# Altium schematic sheet LM2678.SchDoc
size A4; SheetNumber: 1; SheetTotal: 2
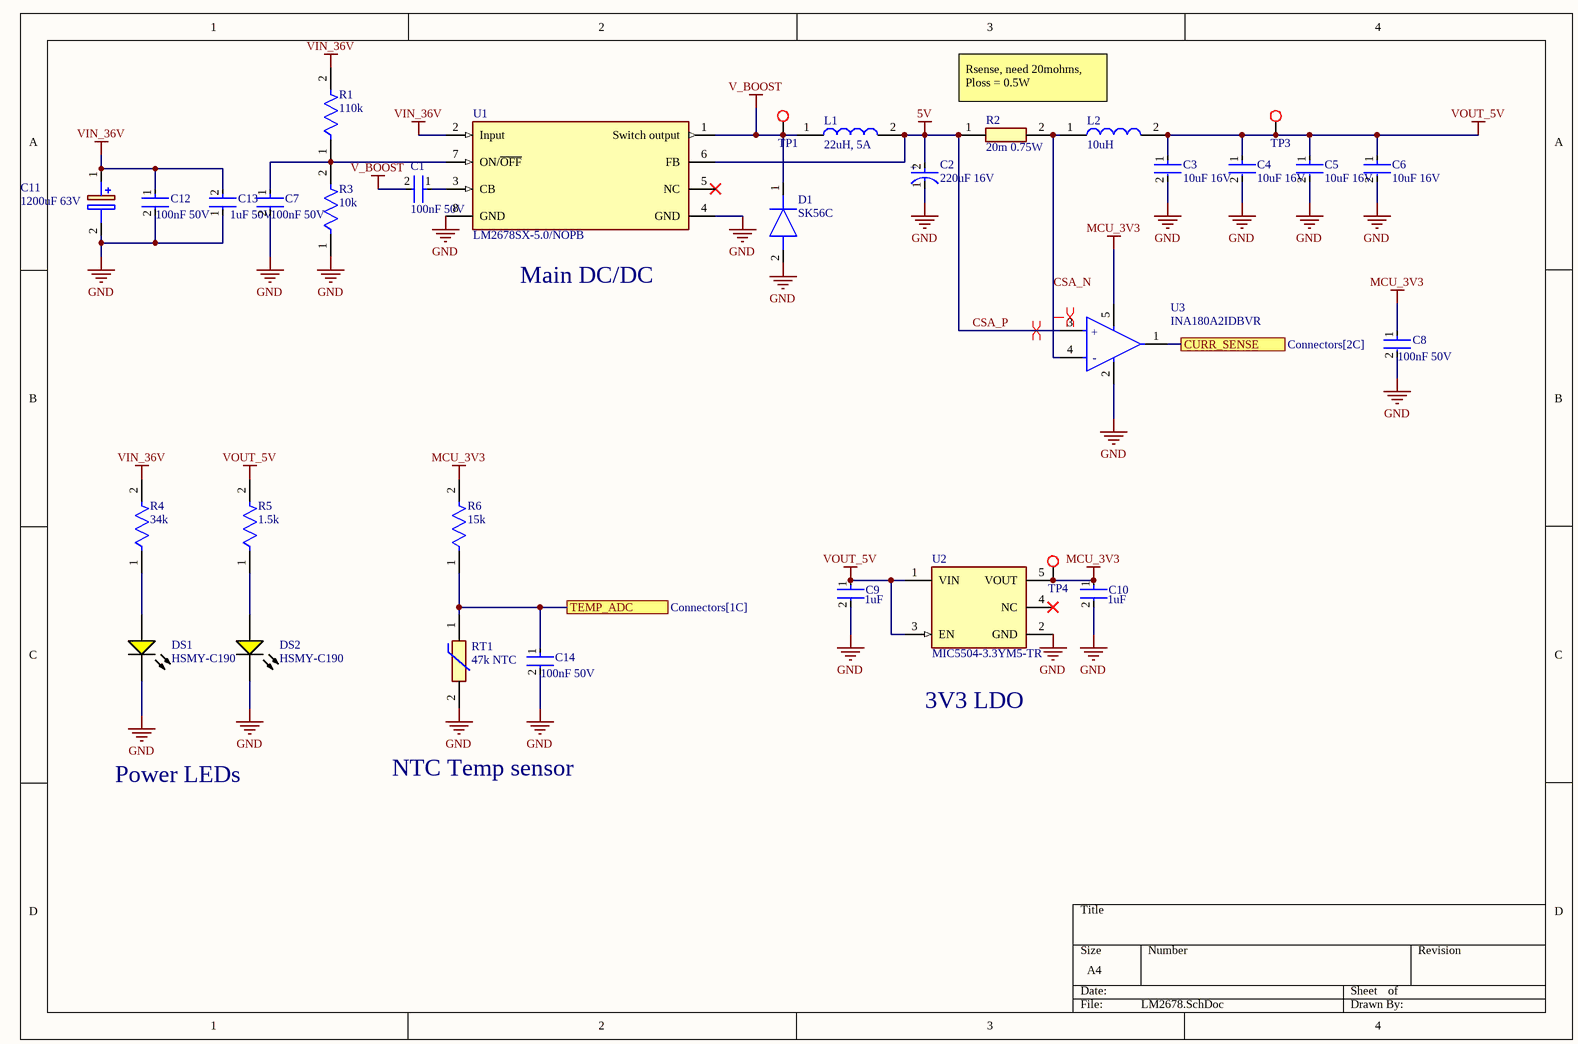
[diagram p0: LM2678.SchDoc]

## Parts
C1  100nF 50V  [FP-CL31-IPC_C]
C2  220uF 16V  [FP-OS-CON-TH-E7-d_0_6-MFG]
C3  10uF 16V  [FP-CL21-IPC_B]
C4  10uF 16V  [FP-CL21-IPC_B]
C5  10uF 16V  [FP-CL21-IPC_B]
C6  10uF 16V  [FP-CL21-IPC_B]
C7  100nF 50V  [FP-CL31-IPC_C]
C8  100nF 50V  [FP-CL31-IPC_C]
C9  1uF  [FP-CL10-IPC_C]
C10  1uF  [FP-CL10-IPC_C]
C11  1200uF 63V  [CAPPRD750W80D1825H3750]
C12  100nF 50V  [FP-CL31-IPC_C]
C13  1uF 50V  [FP-C1608-080-0_1-IPC_B]
C14  100nF 50V  [FP-CL31-IPC_C]
D1  SK56C  [DIOM7959X262N]
DS1  HSMY-C190  [AVAG-HSMX-C190_V]
DS2  HSMY-C190  [AVAG-HSMX-C190_V]
L1  22uH, 5A  [AMRM00101040220MA1]
L2  10uH  [HPC8040NC4R7M]
R1  110k  [FP-RC2012-MFG]
R2  20m 0.75W  [RESC2114X85N]
R3  10k  [FP-MC01W0805-IPC_C]
R4  34k  [FP-CRCW0805-e3-IPC_B]
R5  1.5k  [FP-RC1608-IPC_B]
R6  15k  [FP-CRCW1206-e3-IPC_B]
RT1  47k NTC  [NTCLE100E3473GB0]
TP1  TP  [Testpoint]  (value not drawn)  (no BOM)
TP3  TP  [Testpoint]  (value not drawn)  (no BOM)
TP4  TP  [Testpoint]  (value not drawn)  (no BOM)
U1  LM2678SX-5.0/NOPB  [LM2678SX-5.0/NOPB]
U2  MIC5504-3.3YM5-TR  [FP-SOT23-5LD-PL-1-MFG]
U3  INA180A2IDBVR  [FP-DBV0005A-MFG]

## Ports
CURR_SENSE (see Connectors[2C]), TEMP_ADC (see Connectors[1C])

## Nets
CSA_P: C2.2(A) L1.2 R2.1 U1.6(FB) U3.3(IN+)  [also labelled 5V]
GND: C2.1(C) C3.2 C4.2 C5.2 C6.2 C7.2 C8.2 C9.2 C10.2 C11.2(-) C12.2 C13.1 C14.2 D1.2(A) DS1.2(K) DS2.2(K) R3.1 RT1.2 U1.4(GND) U1.8(GND) U2.2(GND) U3.2(GND)
MCU_3V3: C8.1 C10.1 R6.2 TP4.0 U2.5(VOUT) U3.5(VS)
V_BOOST: C1.2 D1.1(K) L1.1 TP1.0 U1.1(Switch_output)
VIN_36V: C11.1(+) C12.1 C13.2 R1.2 R4.2 U1.2(Input)
VOUT_5V: C3.1 C4.1 C5.1 C6.1 C9.1 L2.2 R5.2 TP3.0 U2.1(VIN) U2.3(EN)
CSA_N: L2.1 R2.2 U3.4(IN-)
CURR_SENSE: U3.1(OUT) ; port CURR_SENSE
TEMP_ADC: C14.1 R6.1 RT1.1 ; port TEMP_ADC
NetC1_1: C1.1 U1.3(CB)
NetC7_1: C7.1 R1.1 R3.2 U1.7(ON/~{OFF})
NetDS1_1: DS1.1(A) R4.1
NetDS2_1: DS2.1(A) R5.1

Not connected (* = marked no-connect by the designer): U1 5(NC)*; U2 4(NC)*

## Layout directives
differential pair: CSA_N, CSA_P

## Notes on the sheet
- Rsense, need 20mohms, Ploss = 0.5W
- (near U1) Main DC/DC
- 3V3 LDO
- Power LEDs
- NTC Temp sensor
- (in symbol CMP-04895-000287-1) +; -
- (in symbol CMP-05428-000165-2) +

## Library data of the parts
C1 C7 C8 C12 C14 = CMP-13271-001276-1: Cap Ceramic 100nF 50V X7R ±10% SMD 1206 +125°C Embossed T/R; Dielectric: X7R; Case Code (Metric): 3216; Package Quantity: 1; Thickness: 0.037inch; Depth: 1.6mm; Packaging: Tape and Reel; Capacitance: 100nF; Length: 0.126inch; Tolerance: 10%; Voltage Rating: 50V; Case Code (Imperial): 1206; Radiation Hardening: No; Width: 0.063inch; Case/Package: 1206; Max Operating Temperature: 125°C; Min Operating Temperature: -55°C; Height: 0.85mm; Mount: Surface Mount
C2 = CMP-05428-000165-2: CAP ALUM POLY 220UF 20% 16V T/H; Life (Hours): 5000Hour; Dissipation Factor: 10%; Leakage Current: 500uA; Lead Diameter: 0.6mm; Ripple Current: 4.15A; ESR (Equivalent Series Resistance): 13mR; Polarity: Polar; Reach SVHC Compliant: Yes; Voltage Rating (DC): 16V; Number of Pins: 7; Length: 7mm; Voltage: 16V; Diameter: 8mm; RoHS Compliant: Yes; Max Operating Temperature: 105°C; Height: 7mm; Capacitance: 220uF; Tolerance: 20%; Voltage Rating: 16V; Mount: Through Hole; Series: OS-CON™, SEPC; Packaging: Bulk; Package Quantity: 200; Termination: Radial; Min Operating Temperature: -55°C; Case/Package: Radial; Lead Pitch: 3.5mm; Height - Seated (Max): 0.276inch; Lead Free: Lead Free
C3-C6 = CMP-2000-06102-2: CL21 Series 0805 10uF 16V ±10% Tolerance X5R Multilayer Ceramic Chip Capacitor; Dielectric: X7R; Length: 2mm; Depth: 1.25mm; Voltage: 16V; Width: 0.049inch; Capacitance: 10uF; Lead Free: Lead Free; Max Operating Temperature: 85°C; Mount: Surface Mount; Voltage Rating: 16V; Height: 1.25mm; Radiation Hardening: No; Packaging: Tape and Reel; Voltage Rating (DC): 16V; Thickness: 0.055inch; Case/Package: 0805; Case Code (Imperial): 0805; Min Operating Temperature: -55°C; Case Code (Metric): 2012; Package Quantity: 1; Tolerance: 10%
C9 C10 = CMP-13271-003399-1: Cap Ceramic 1uF 10V X5R ±10% Pad SMD 0603 +85°C T/R; Min Operating Temperature: -55°C; Max Operating Temperature: 85°C; Dielectric: X5R; Contact Plating: Tin; Height: 0.8mm; Voltage: 10V; Packaging: Tape and Reel; Voltage Rating: 10V; Capacitance: 1uF; Package Quantity: 1; Width: 0.031inch; Length: 1.6mm; Depth: 0.8mm; Case/Package: 0603; Case Code (Imperial): 0603; Thickness: 0.035inch; Radiation Hardening: No; Tolerance: 10%; Case Code (Metric): 1608; Mount: Surface Mount
C11 = UHE1J122MHD6: Capacitor Polarised; Manufacturer_Name: Nichicon; Datasheet Link: https://products.nichicon.co.jp/en/pdf/XJA043/e-uhe.pdf; Height: 37.5mm; Manufacturer_Part_Number: UHE1J122MHD6; Mouser Part Number: 647-UHE1J122MHD6; Mouser Price/Stock: https://www.mouser.co.uk/ProductDetail/Nichicon/UHE1J122MHD6?qs=3w7tHOhcdefSsEo8Zd8Pmw%3D%3D; Arrow Part Number: UHE1J122MHD6; Arrow Price/Stock: https://www.arrow.com/en/products/uhe1j122mhd6/nichicon; Supplier 1: Digikey; Supplier Part Number 1: 493-1656-ND
C13 = CMP-2000-06025-2: Multilayer Ceramic Capacitors 1μF ±10% 50V X5R SMD 0603; Lead Free: Lead Free; Height: 0.8mm; Mount: Surface Mount; Radiation Hardening: No; Thickness: 0.035inch; Length: 1.6mm; Max Operating Temperature: 85°C; REACH SVHC: No SVHC; Min Operating Temperature: -55°C; Construction: Flat; RoHS Compliant: Yes; Voltage Rating: 50V; Dielectric: X5R; Packaging: Tape and Reel; Termination: SMD/SMT; Voltage Rating (DC): 50V; Case Code (Imperial): 0603; Voltage: 50V; Width: 0.031inch; Weight: 7.1E-05oz; Capacitance: 1uF; Depth: 0.8mm; Case Code (Metric): 1608; Series: C; Case/Package: 0603; Tolerance: 10%; Resistor Type: Ceramic; Number of Pins: 2; Dielectric Material: Ceramic; Package Quantity: 1
D1 = SK56C: Diode; Manufacturer_Name: Taiwan Semiconductor; Datasheet Link: https://mouser.componentsearchengine.com/Datasheets/2/SK56C.pdf; Height: 2.62mm; Manufacturer_Part_Number: SK56C; Mouser Part Number: 821-SK56C; Mouser Price/Stock: https://www.mouser.co.uk/ProductDetail/Taiwan-Semiconductor/SK56C?qs=tHU%2FlV7kTyQlv9uyXcuY8g%3D%3D
DS1 DS2 = CMP-1744-00003-1: LED Uni-Color Yellow, 65 mW, 20 mA, -40 to 85 degC, 2-Pin SMD, RoHS, Tape and Reel; Tolerance: 1%; Voltage Rating: 50 V; Power Rating: 100 mW; Case\Package: 0603; Resistance: 390 Ohm; Min Operating Temperature: -55 degC; Length: 1.6 mm; ComponentLink3Description: Package Specification; Mount: Surface Mount; PackageReference: HSMX-C190; ComponentLink2Description: Datasheet; DatasheetVersion: Mar-12; Case Code (Metric): 1608; Pins: 2; Package Quantity: 5000; ComponentLink2URL: http://docs.avagotech.com/docs/AV02-0551EN; ComponentLink1Description: Manufacturer URL; RoHSCompliant: true; Packaging: Tape and Reel; PackageDescription: 2-Pin Surface Mount Device, Body 1.6 x 0.8 mm, Height 0.9 mm; REACH SVHC: No SVHC; ComponentLink3URL: http://www.fairchildsemi.com/dwg/MA/MA03D.pdf; Voltage Rating (DC): 50 V; Width: 0.8 mm; ComponentLink1URL: http://www.avagotech.com/; Max Operating Temperature: 155 degC; Case Code (Imperial): 0603; Height: 0.45 mm
L1 = AMRM00101040220MA1: Inductor; Manufacturer_Name: Pulse Electronics; Datasheet Link: https://productfinder.pulseelectronics.com/api/open/part-attachments/datasheet/amrm00101040220ma1; Height: 4mm; Manufacturer_Part_Number: AMRM00101040220MA1; Mouser Part Number: 673-AMRM101040220MA1; Mouser Price/Stock: https://www.mouser.co.uk/ProductDetail/Pulse-Electronics/AMRM00101040220MA1?qs=HoCaDK9Nz5furma8MQ%2FytQ%3D%3D
L2 = HPC8040NC-4R7M: Inductor; Manufacturer_Name: TAI-TECH; Datasheet Link: https://media.digikey.com/pdf/Data%20Sheets/Tai%20Tech%20PDFs/HPC-BM_NF_NCv.pdf; Height: 4.2mm; Manufacturer_Part_Number: HPC8040NC-4R7M; Supplier 1: Digikey; Supplier Part Number 1: 4816-HPC8040NC-100MCT-ND
R1 = CMP-13261-001773-1: Res Thick Film 0805 110kΩ 1% 0.125W ±100ppm/°C Molded SMD T/R; Resistance: 110kR; Max Power Dissipation: 125mW; Voltage Rating (DC): 150V; Packaging: Tape and Reel; Height: 0.024inch; Case/Package: 0805; Composition: Thick Film; Features: Moisture Resistant; Contact Plating: Tin; Military Standard: Not; Case Code (Imperial): 0805; Tolerance: 1%; Width: 0.049inch; Number of Terminations: 2; Lead Free: Lead Free; Min Operating Temperature: -55°C; Radiation Hardening: No; Length: 0.079inch; Depth: 1.25mm; Case Code (Metric): 2012; Temperature Coefficient: 100ppm/°C; Max Operating Temperature: 155°C
R2 = D1WEL0805CR080F-T5: Resistor; Manufacturer_Name: Thin Film Technology Corp.; Datasheet Link: https://mm.digikey.com/Volume0/opasdata/d220001/medias/docus/5732/TFT-DMS-423-1.pdf; Height: 0.85mm; Manufacturer_Part_Number: D1WEL0805CR080F-T5
R3 = CMP-12256-000003-1: Resistor, 10K, 0.1W, 1%, 0805, Reel; Resistance: 10kR; Voltage Rating: 150V; Temperature Coefficient: 100ppm/°C; Power Rating: 100mW; REACH SVHC: No SVHC; Composition: Thick Film; Max Operating Temperature: 155°C; Case/Package: 0805; Tolerance: 1%; Number of Pins: 2; Case Code (Metric): 2012; Voltage Rating (DC): 150V; Min Operating Temperature: -55°C; Width: 1.25mm; Case Code (Imperial): 0805; Packaging: Cut Tape
R4 = CMP-2001-03837-2: RES Thick Film, 34kΩ, 1%, 0.125W, 100ppm/°C, 0805; Resistance: 34kR; Max Power Dissipation: 125mW; Voltage Rating (DC): 150V; Radiation Hardening: No; Case Code (Metric): 2012; Weight: 0.000194oz; Composition: Thick Film; Lead Free: Lead Free; Military Standard: Not; Contact Plating: Tin; Height: 0.02inch; Packaging: Tape and Reel; Depth: 1.25mm; Max Operating Temperature: 155°C; Temperature Coefficient: 100ppm/°C; Width: 0.049inch; Case/Package: 0805; Number of Terminations: 2; Working Voltage: 150V; Power Rating: 125mW; Package Quantity: 10; Min Operating Temperature: -55°C; Termination: SMD/SMT; Features: Automotive AEC-Q200; Tolerance: 1%; Case Code (Imperial): 0805; Voltage Rating: 150V; Length: 2mm
R5 = CMP-13261-004935-1: Res Thick Film 0603 1.5kΩ 1% 0.1W ±100ppm/°C Molded SMD T/R; Resistance: 1.5kR; Voltage Rating (DC): 50V; Power Rating: 100mW; Contact Plating: Tin; Depth: 0.8mm; Width: 800um; Tolerance: 1%; Lead Free: Lead Free; Composition: Thick Film; Military Standard: Not; Temperature Coefficient: 100ppm/°C; Radiation Hardening: No; Length: 1.6mm; Case/Package: 0603; Max Operating Temperature: 155°C; Packaging: Tape and Reel; Min Operating Temperature: -55°C
R6 = CMP-1014-00102-3: RES Thick Film, 15kΩ, 5%, 0.25W, 200ppm/°C, 1206; Max Power Dissipation: 250mW; Voltage Rating (DC): 200V; Resistance: 15kR; Temperature Coefficient: 200ppm/°C; Height: 0.024inch; Case Code (Metric): 3216; Package Quantity: 1; Power Rating: 250mW; Depth: 1.6mm; Lead Free: Lead Free; Features: Automotive AEC-Q200; Width: 1.6mm; Composition: Thick Film; Military Standard: Not; Number of Terminations: 2; Height - Seated (Max): 0.024inch; Radiation Hardening: No; Termination: SMD/SMT; Voltage Rating: 200V; Min Operating Temperature: -55°C; Length: 3.2mm; Tolerance: 5%; Case/Package: 1206; Weight: 0.000353oz; Max Operating Temperature: 155°C; Case Code (Imperial): 1206; Packaging: Tape and Reel; Contact Plating: Tin
RT1 = NTCLE100E3473GB0: Thermistor; Manufacturer_Name: Vishay; Datasheet Link: https://www.vishay.com/docs/29049/ntcle100.pdf; Height: 8mm; Manufacturer_Part_Number: NTCLE100E3473GB0; Mouser Part Number: 594-NTCLE100E3473GB0; Mouser Price/Stock: https://www.mouser.co.uk/ProductDetail/Vishay-BC-Components/NTCLE100E3473GB0?qs=%2FWiulJ9oly60Fl5s5HThvA%3D%3D; Arrow Part Number: NTCLE100E3473GB0; Arrow Price/Stock: https://www.arrow.com/en/products/ntcle100e3473gb0/vishay?region=nac
TP1 TP3 TP4 = Testpoint
U2 = CMP-2000-07604-2: IC REG LINEAR 3.3V 300MA SOT23-5; Quiescent Current: 38uA; Operating Supply Current: 42uA; Max Input Voltage: 5.5V; Min Input Voltage: 2.5V; Output Type: Fixed; Power Supply Rejection Ratio (PSRR): 60dB; Dropout Voltage: 380mV; Accuracy: 3%; Number of Outputs: 1; Nominal Output Voltage: 3.3V; Max Output Current: 300mA; Length: 2.9mm; Mount: Surface Mount; Width: 1.6mm; Packaging: Tape and Reel; Output Current: 300mA; Min Operating Temperature: -40°C; Max Operating Temperature: 125°C; Height: 1.1mm; Case/Package: SOT-23-5; REACH SVHC: No SVHC; Number of Pins: 5; Output Voltage: 3.3V
U3 = CMP-04895-000287-1: IC CURR SENSE 1 CIRCUIT SOT23-5; Operating Supply Current: 260uA; -3db Bandwidth: 350kHz; Slew Rate: 2V/µs; Number of Circuits: 1; Input Offset Voltage (Vos): 100uV; Input Bias Current: 100nA; Mount: Surface Mount; Max Operating Temperature: 125°C; Packaging: Tape and Reel; Min Operating Temperature: -40°C; Case/Package: SOT-23-5; RoHS Compliant: Yes